# EAGLE design control_board (EAGLE 9.1.0)
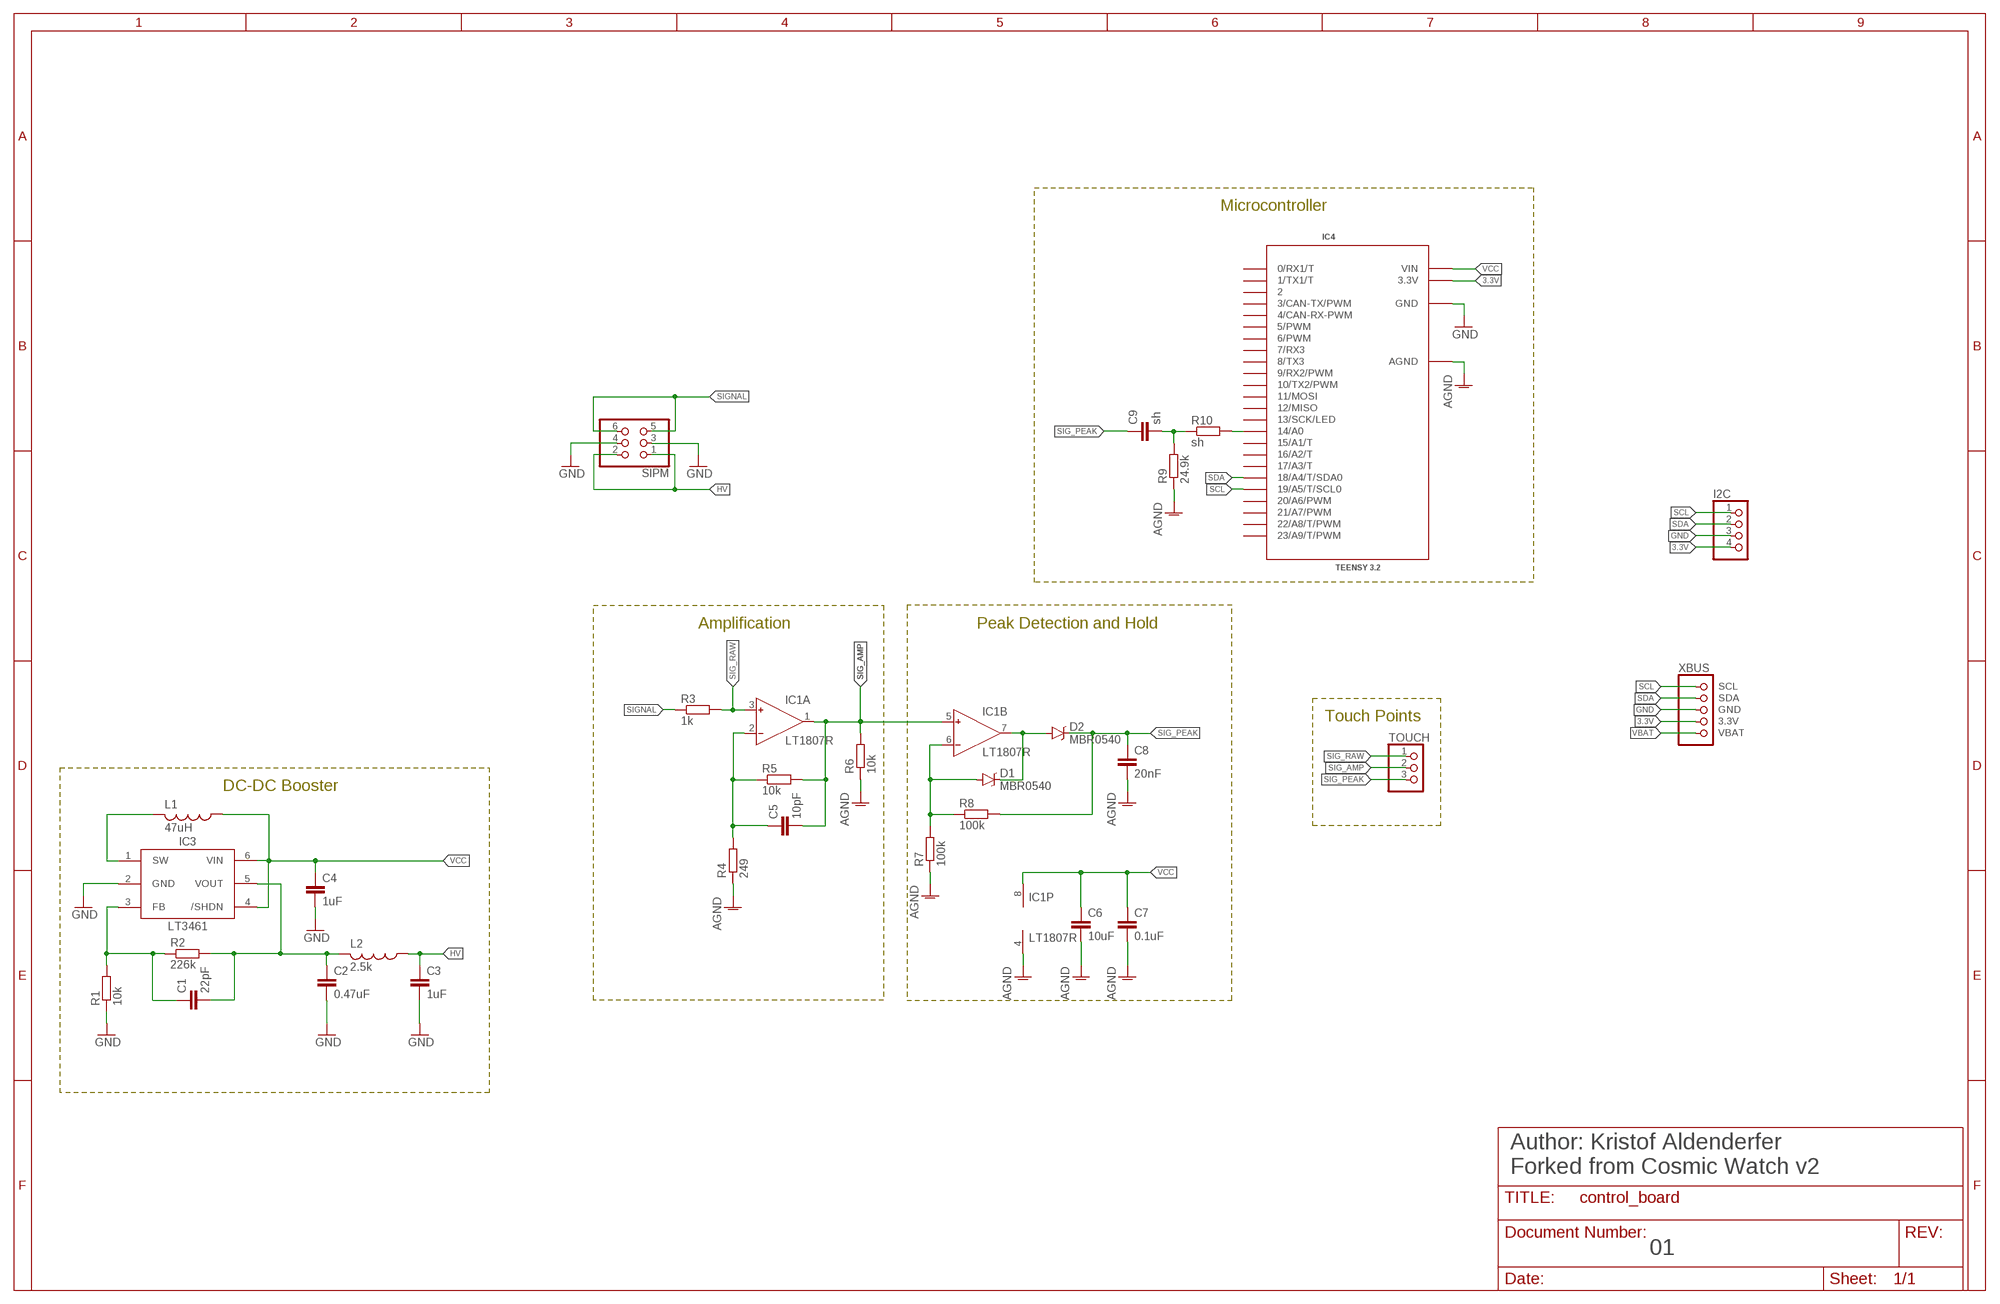
[diagram p0: schematic, sheet 1]

## Parts
C1  22pF  C-EUC0805K  [C0805K]
C2  0.47uF  C-EUC0805K  [C0805K]
C3  1uF  C-EUC0805K  [C0805K]
C4  1uF  C-EUC0805K  [C0805K]
C5  10pF  C-EUC0805K  [C0805K]
C6  10uF  C-EUC0805K  [C0805K]
C7  0.1uF  C-EUC0805K  [C0805K]
C8  20nF  C-EUC0805K  [C0805K]
C9  sh  C-EUC0805K  [C0805K]
D1  MBR0540  DIODE-SCHOTTKY-B340A  [SMA-DIODE]
D2  MBR0540  DIODE-SCHOTTKY-B340A  [SMA-DIODE]
I2C  PINHD-1X4  [1X04]
IC1  LT1807R  [SO8]
IC3  LT3461  [SOT23-6]
IC4  TEENSY 3.2  TEENSY_3.2_NO_BOTTOM  [TEENSY_3.2_NO_BOTTOM]
L1  47uH  L-USL2012C  [L2012C]
L2  2.5k  L-USL2012C  [L2012C]
R1  10k  R-EU_M0805  [M0805]
R2  226k  R-EU_M0805  [M0805]
R3  1k  R-EU_M0805  [M0805]
R4  249  R-EU_M0805  [M0805]
R5  10k  R-EU_M0805  [M0805]
R6  10k  R-EU_M0805  [M0805]
R7  100k  R-EU_M0805  [M0805]
R8  100k  R-EU_M0805  [M0805]
R9  24.9k  R-EU_M0805  [M0805]
R10  sh  R-EU_M0805  [M0805]
SIPM  PINHD-2X3  [2X03]
TOUCH  PINHD-1X3  [1X03]
XBUS  XINABOX-XBUS  [XBUS_1X05_PAD]

## Nets
3.3V: I2C.4 IC4.3.3V XBUS.P4B(3.3V) XBUS.P4T(3.3V)
AGND: C6.2 C7.2 C8.2 IC1.4(P:V-) IC4.AGND R4.1 R6.1 R7.1 R9.1
GND: C2.2 C3.2 C4.2 I2C.3 IC3.2(GND) IC4.GND R1.1 SIPM.3 SIPM.4 XBUS.P3B(GND) XBUS.P3T(GND)
HV: C3.1 L2.1 SIPM.1 SIPM.2
N$1: IC3.1(SW) L1.2
N$2: D1.C D2.A IC1.7(B:OUT)
N$3: C1.1 IC3.3(FB) R1.2 R2.1
N$4: D1.A IC1.6(B:IN-) R7.2 R8.1
N$7: C1.2 C2.1 IC3.5(VOUT) L2.2 R2.2
N$8: C5.1 IC1.2(A:IN-) R4.2 R5.1
N$9: C9.2 R9.2 R10.1
N$10: IC4.14/A0 R10.2
SCL: I2C.1 IC4.19/A5(19/A5/T/SCL0) XBUS.P1B(SCL) XBUS.P1T(SCL)
SDA: I2C.2 IC4.18/A4(18/A4/T/SDA0) XBUS.P2B(SDA) XBUS.P2T(SDA)
SIG_AMP: C5.2 IC1.1(A:OUT) IC1.5(B:IN+) R5.2 R6.2 TOUCH.2
SIG_PEAK: C8.1 C9.1 D2.C R8.2 TOUCH.3
SIG_RAW: IC1.3(A:IN+) R3.2 TOUCH.1
SIGNAL: R3.1 SIPM.5 SIPM.6
VBAT: XBUS.P5B(VBAT) XBUS.P5T(VBAT)
VCC: C4.1 C6.1 C7.1 IC1.8(P:V+) IC3.4(/SHDN) IC3.6(VIN) IC4.VIN L1.1
Unconnected: IC4.0(0/RX1/T) IC4.1(1/TX1/T) IC4.2 IC4.3(3/CAN-TX/PWM) IC4.4(4/CAN-RX-PWM) IC4.5(5/PWM) IC4.6(6/PWM) IC4.7(7/RX3) IC4.8(8/TX3) IC4.9(9/RX2/PWM) IC4.10(10/TX2/PWM) IC4.11(11/MOSI) IC4.12(12/MISO) IC4.13(13/SCK/LED) IC4.15/A1(15/A1/T) IC4.16/A2(16/A2/T) IC4.17/A3(17/A3/T) IC4.20/A6(20/A6/PWM) IC4.21/A7(21/A7/PWM) IC4.22/A8(22/A8/T/PWM) IC4.23/A9(23/A9/T/PWM)

## Notes on the sheet
- Microcontroller
- Amplification | Peak Detection and Hold
- Touch Points
- DC-DC Booster
- Author: Kristof Aldenderfer
  Forked from Cosmic Watch v2
- 01

## Library data of the parts
C1-C9 = rcl:C-EU: CAPACITOR, European symbol; SPICEPREFIX: C
D1 D2 = SparkFun-DiscreteSemi:DIODE-SCHOTTKY: Schottky diodes in SFE's production catalog BAT20J 1A 23V 0.62Vf RB751 120mA 40V 0.37Vf PMEG4005EJ 0.5A 40V 0.42Vf MBRA140 1A 40V 0.5Vf B340A 3A 40V SMA; PROD_ID: DIO-09886; VALUE: B340A
I2C = pinhead:PINHD-1X4: PIN HEADER
IC1 = personal:LT1807: Dual Precision, 500 ns Settling, BiFET Op Amp Source: http://www.analog.com/static/imported-files/data_sheets/AD746.pdf; MF: ALTERA CORPORATION; MPN: AD746JRZ; OC_FARNELL: 1423876; OC_NEWARK: 59K4845
IC3 = personal:LT3461: LT3426 1.2MHz, 2A boost converter in SOT-23 http://www.linear.com/pc/productDetail.jsp?navId=H0,C1,C1003,C1042,C1031,C1061,P8430 (Linear website)
IC4 = personal:TEENSY_3.2_NO_BOTTOM: Footprint for Teensy 3.1 board using all pin connections on the outer perimeter
L1 L2 = rcl:L-US: INDUCTOR, American symbol; SPICEPREFIX: L
R1-R10 = rcl:R-EU_: RESISTOR, European symbol; SPICEPREFIX: R
SIPM = pinhead:PINHD-2X3: PIN HEADER
TOUCH = pinhead:PINHD-1X3: PIN HEADER
XBUS = personal:XINABOX-XBUS: PIN HEADER

## Board
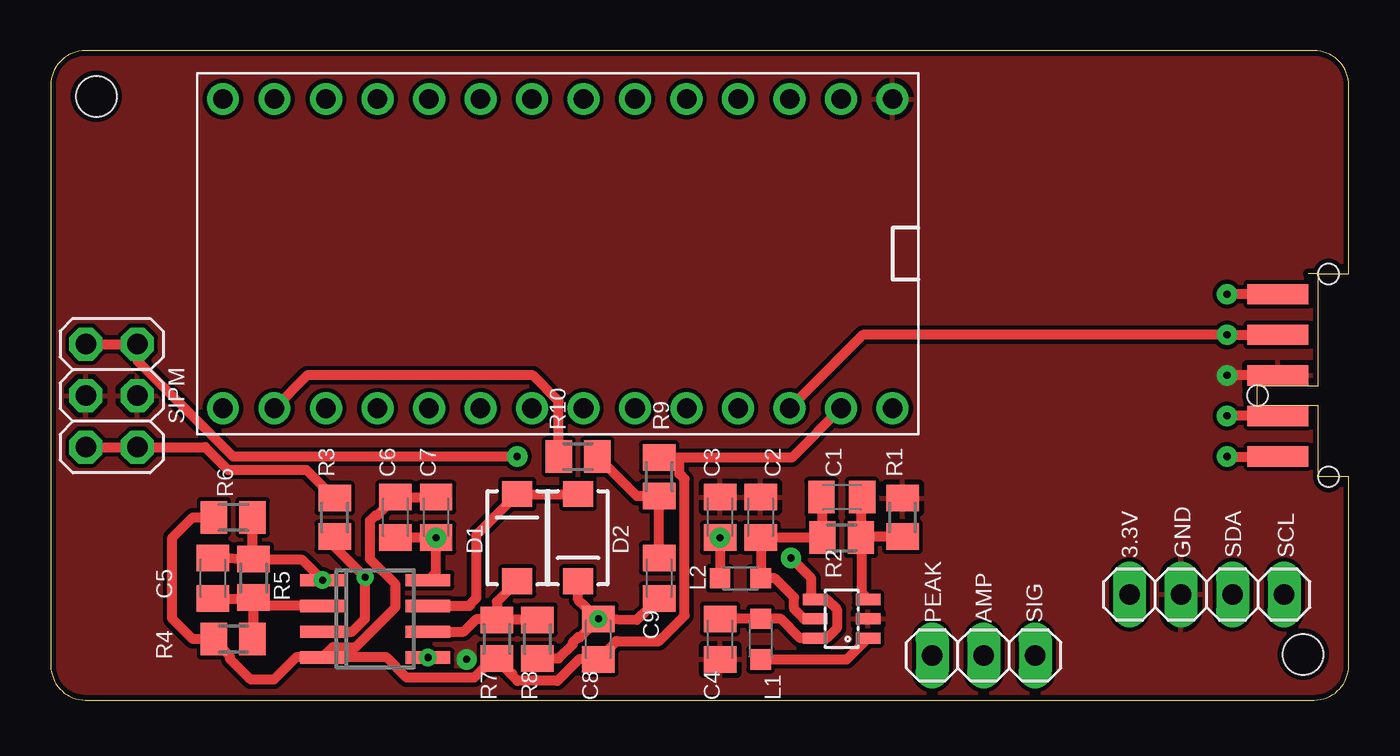
[diagram p1: board, top side]
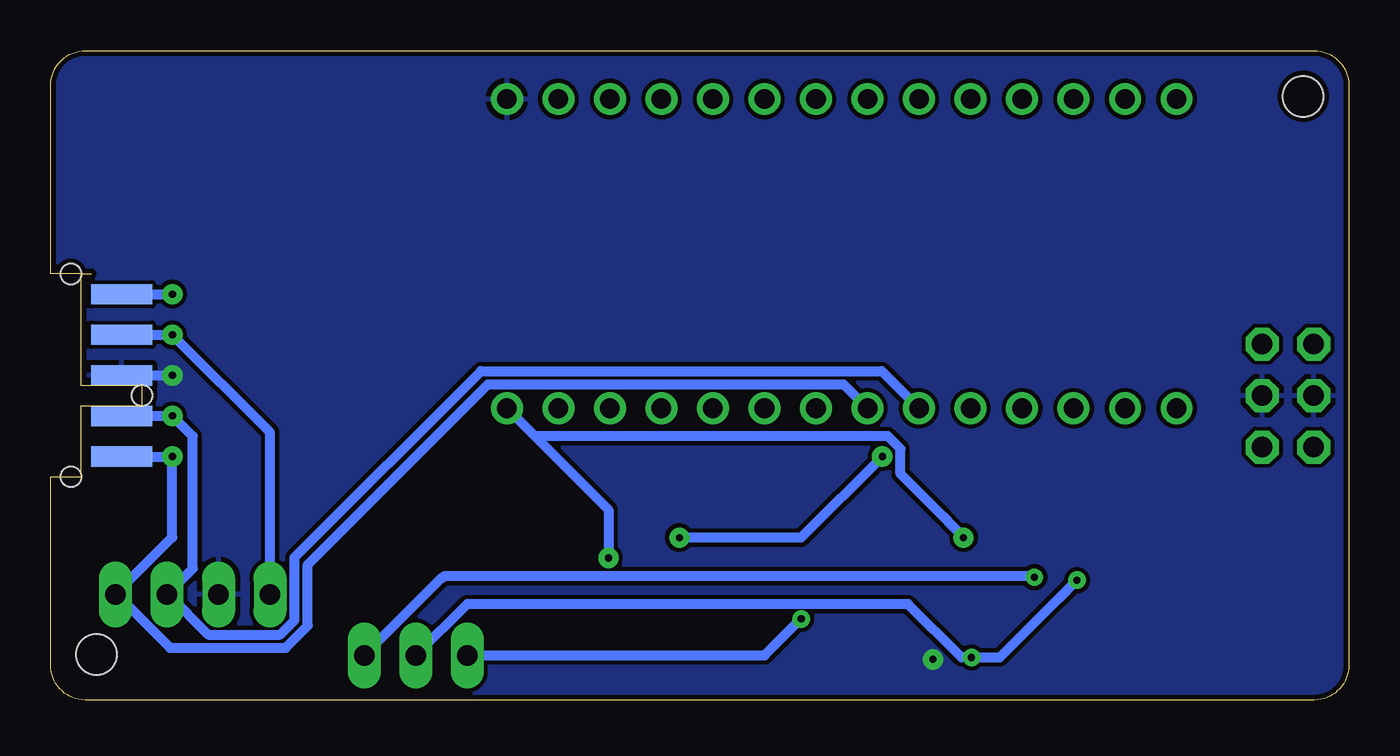
[diagram p2: board, bottom side, seen from below]

Size 64 x 32 mm. Coordinates in mm from the lower left corner, seen from the top.
Outline: 62.5,21 62.5,15.5 59.5,15.5 59.5,14.5 62.5,14.5 62.5,11 64,11 64,1.71 arc-90 62.29,0 1.71,0 arc-90 0,1.71 0,30.29 arc-90 1.71,32 62.29,32 arc-90 64,30.29 64,21 62.5,21
Outline: 62.5,21 62,21
Copper layers (1*16): Top 0.035mm / dielectric 1.5mm / Bottom 0.035mm
Design rules "SparkFun": minimum track width 8mil, minimum drill 20mil, track to track 8mil, track to pad 8mil, pad to pad 8mil, via to via 8mil, smd to smd 8mil, copper to edge 10mil, drill to drill 8mil, minimum pad ring 12mil, minimum via ring 10mil, stop-mask expansion 4mil, vias tented up to drill 25mil, thermal gap 10mil
Holes 1 mm at 63,11 63,21 59.5,15
Holes 2 mm at 61.75,2.25 2.25,29.75

### Footprints (pad centres in the part's own frame; a part is rotated, then mirrored left to right if it is on the bottom)
C0805K = smd 1.3 x 1.6: 1 -1,0; 2 1,0
SMA-DIODE = smd 1.27 x 1.47: A -2.15,0; C 2.15,0
1X04 = drill 1.016 long: 1 -3.81,0; 2 -1.27,0; 3 1.27,0; 4 3.81,0
SO8 = smd 0.6 x 2.2: 1 -1.905,-2.6; 2 -0.635,-2.6; 3 0.635,-2.6; 4 1.905,-2.6; 5 1.905,2.6; 6 0.635,2.6; 7 -0.635,2.6; 8 -1.905,2.6
SOT23-6 = smd 0.55 x 1.2: 1 -0.95,-1.3; 2 0,-1.3; 3 0.95,-1.3; 4 0.95,1.3; 5 0,1.3; 6 -0.95,1.3
TEENSY_3.2_NO_BOTTOM = drill 0.965: 0 -7.62,13.97; 1 -7.62,11.43; 2 -7.62,8.89; 3 -7.62,6.35; 3.3V 7.62,11.43; 4 -7.62,3.81; 5 -7.62,1.27; 6 -7.62,-1.27; 7 -7.62,-3.81; 8 -7.62,-6.35; 9 -7.62,-8.89; 10 -7.62,-11.43; 11 -7.62,-13.97; 12 -7.62,-16.51; 13 7.62,-16.51; 14/A0 7.62,-13.97; 15/A1 7.62,-11.43; 16/A2 7.62,-8.89; 17/A3 7.62,-6.35; 18/A4 7.62,-3.81; 19/A5 7.62,-1.27; 20/A6 7.62,1.27; 21/A7 7.62,3.81; 22/A8 7.62,6.35; 23/A9 7.62,8.89; AGND 7.62,13.97; GND -7.62,16.51; VIN 7.62,16.51
L2012C = smd 1 x 1: 1 -1,0; 2 1,0
M0805 = smd 1.3 x 1.6: 1 -0.95,0; 2 0.95,0
2X03 = drill 1.016 octagon: 1 -2.54,-1.27; 2 -2.54,1.27; 3 0,-1.27; 4 0,1.27; 5 2.54,-1.27; 6 2.54,1.27
1X03 = drill 1.016 long: 1 -2.54,0; 2 0,0; 3 2.54,0
XBUS_1X05_PAD = smd 1 x 3 bottom: P1B -4,0; P2B -2,0; P3B 0,0; P4B 2,0; P5B 4,0 | smd 1 x 3: P1T -4,0; P2T -2,0; P3T 0,0; P4T 2,0; P5T 4,0

### Placement (x,y rotation side)
C1  39,10 180 top
C2  35,9 90 top
C3  33,9 90 top
C4  33,3 270 top
C5  8,6 90 top
C6  17,9 90 top
C7  19,9 90 top
C8  27,3 270 top
C9  30,6 90 top
D1  23,8 90 top
D2  26,8 270 top
I2C  57,5.2 180 top
IC1  16,4 270 top
IC3  39,4 90 top
IC4  25,22 270 top
L1  35,3 270 top
L2  34,6 0 top
R1  42,9 270 top
R2  39,8 180 top
R3  14,9 270 top
R4  9,3 0 top
R5  10,6 90 top
R6  9,9 0 top
R7  22,3 90 top
R8  24,3 270 top
R9  30,11 270 top
R10  26,12 180 top
SIPM  3,15 270 top
TOUCH  46,2.2 180 top
XBUS  60.5,16 90 top

### Tracks (layer width: path | path; a pad name or v marks a point on that pad's centre or on a via)
3.3V  (via drill 0.35 pad 1)
  Top 0.5: XBUS.P4T v58,18 40.05,18 IC4.3.3V
  Bottom 0.5: XBUS.P4T v58,18 53.19,13.19 I2C.4
AGND
  Top 0.5: IC4.AGND 36.54,11.95 31,11.95 | 31,11.95 R9.1 | C7.2 C6.2 16.1,9.1 16.01,9.1 15.75,8.84 15.75,6.95 17,5.7 17,4.58 15.03,2.61 13.92,2.61 IC1.4 | R4.1 8,3 | 8,3 7,3 6,4 6,8 7,9 R6.1 | 23.01,0.95 24.99,0.95 26.04,2 C8.2 27.9,2.9 29.99,2.9 31.25,4.16 31.25,10.89 31,11.14 31,11.95 | 23.01,0.95 22.75,1.21 22.75,1.3 R7.1 | 23.01,0.95 21.86,2.1 21.4,1.63 20.87,1.1 17.56,1.1 16.56,2.1 IC1.4 | IC1.4 12.09,2.1 11,1 9.86,1 8.85,2.01 8.85,2.15 8,3
GND  (via drill 0.35 pad 1)
  Top 0.5: XBUS.P3B v58,16
  Bottom 0.5: XBUS.P3B v58,16
  other vias: 20.5,2
  pour Bottom: -1,-1 65,-1 65,33 -1,33
  pour Top: -2,-2 66,-2 66,34 -2,34
HV  (via drill 0.35 pad 1)
  Top 0.5: C3.1 L2.1 | v23,12 9,12 4.27,16.73 SIPM.2 SIPM.1
  Bottom 0.5: v23,12 27,8 C3.1
  other vias: 33,8
N$1
  Top 0.5: IC3.1 39.25,2 L1.2
N$2
  Top 0.5: IC1.7 20.63,4.63 20.75,4.75 20.75,4.79 20.98,5.02 20.98,8.13 D1.C D2.A
N$3
  Top 0.5: R1.2 40,8.05 | 40,8.05 R2.1 C1.1 | IC3.3 40,5.25 40,8.05
N$4
  Top 0.5: IC1.6 20.37,3.37 21,4 21.95,4 R7.2 | R8.1 R7.2 | D1.A 22,4.85 R7.2
N$7
  Top 0.5: C1.2 R2.2 35.05,8 | 35.05,8 C2.1 | 35.05,8 35.05,6.05 L2.2 35.7,6 36.65,5.05 36.65,4.49 37.13,4 IC3.5
N$8
  Top 0.5: R4.2 10,3.05 10,5 | 10,5 R5.1 | C5.1 8.05,5 10,5 | IC1.2 10,4.63
N$9
  Top 0.5: C9.2 R9.2 28.9,10.05 R10.1
N$10
  Top 0.5: IC4.14/A0 12.65,16 23.77,16 25.05,14.72 R10.2
SCL  (via drill 0.35 pad 1)
  Top 0.5: v58,12 XBUS.P1B
  Bottom 0.5: XBUS.P1B v58,12 58,8.01 I2C.1 60.75,5.2 58.12,2.57 52.42,2.57 51.32,3.66 51.32,6.68 42.44,15.56 24.91,15.56 IC4.19/A5
SDA  (via drill 0.35 pad 1)
  Top 0.5: XBUS.P2T v58,14
  Bottom 0.5: XBUS.P2T v58,14 57,13 57,6.47 I2C.2 58.21,5.2 56.23,3.22 52.69,3.22 51.97,3.94 51.97,7.03 42.79,16.21 23.02,16.21 IC4.18/A4
SIG_AMP  (via drill 0.35)
  Top 0.5: C5.2 R5.2 | R5.2 9.95,7 R6.2 | R5.2 10.05,6.91 12.4,6.91 IC1.1
  Bottom 0.5: 14.3,5 IC1.1 17.21,2.1 v18.6,2.1 19.09,2.1 21.73,4.73 43.47,4.73 TOUCH.2
  other vias: 13.4,5.91
SIG_PEAK  (via drill 0.35)
  Top 0.5: C8.1 26,4.95 D2.C | C8.1 28.9,3.95 C9.1 | R8.2 25.05,2.05 25.75,2.75 25.75,2.84 26.01,3.1 26.1,3.1 C8.1
  Bottom 0.5: TOUCH.3 28.8,2.2 C8.1
  other vias: 27,4
SIG_RAW  (via drill 0.35)
  Top 0.5: IC1.3 14.87,3.37 15.5,4 v15.5,6.05 14,7.55 R3.2
  Bottom 0.5: v15.5,6.05 15.5,6.1 44.61,6.1 44.69,6.02 44.72,6.02 TOUCH.1
SIGNAL
  Top 0.5: SIPM.5 SIPM.6 7.62,12.46 8.73,11.35 12.6,11.35 R3.1
VBAT  (via drill 0.35 pad 1)
  Top 0.5: XBUS.P5T v58,20
  Bottom 0.5: XBUS.P5T v58,20
VCC  (via drill 0.35 pad 1)
  Top 0.5: C4.1 L1.1 36,4 36.95,3.05 IC3.6 38.27,3.05 38.75,3.54 38.75,4.46 38.27,4.95 IC3.4 37.5,5.15 37.5,6 v36.5,7 | IC1.8 19,6.3 C7.1 C6.1
  Bottom 0.5: C7.1 20,9.05 22.1,11.15 22.1,12.37 22.72,13 40.13,13 | IC4.VIN 40.13,13 | 40.13,13 36.5,9.37 v36.5,7
  other vias: 19,8

### Text on the board
tNames: 3.3V | GND | SDA | SCL | PEAK | AMP | SIG